# Altium schematic sheet soldeer.SchDoc
size A4; SheetNumber: 3; SheetTotal: 4
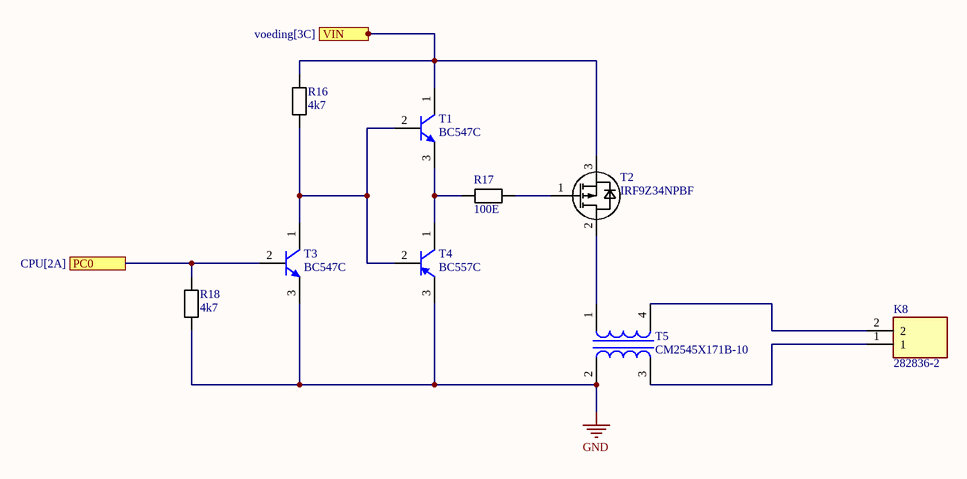
[diagram p0: soldeer.SchDoc]

## Parts
K8  282836-2  [Schroefconnector 2 Pin]
R16  4k7  [registor]
R17  100E  [registor]
R18  4k7  [registor]
T1  BC547C  [BC547C]
T2  IRF9Z34NPBF  [IRF9Z34NPBF]
T3  BC547C  [BC547C]
T4  BC557C  [BC557C]
T5  CM2545X171B-10  [CM2545X171B-10]

## Ports
PC0 (see CPU[2A]), VIN (see voeding[3C])

## Nets
GND: R18.1 T3.3(E) T4.3(E) T5.2
PC0: R18.2 T3.2(B) ; port PC0
VIN: R16.2 T1.1(C) T2.3(SOURCE) ; port VIN
NetK8_1: K8.1 T5.3
NetK8_2: K8.2 T5.4
NetR16_1: R16.1 T1.2(B) T3.1(C) T4.2(B)
NetR17_1: R17.1 T1.3(E) T4.1(C)
NetR17_2: R17.2 T2.1(GATE)
NetT2_2: T2.2(DRAIN) T5.1

## Library data of the parts
K8 = Schroefconnector 2 Pin L: Connector; Manufacturer_Name: TE Connectivity; Datasheet Link: https://www.te.com/commerce/DocumentDelivery/DDEController?Action=showdoc&DocId=Customer+Drawing%7F282836%7FJ%7Fpdf%7FEnglish%7FENG_CD_282836_J.pdf%7F282836-2; Height: 10mm; Manufacturer_Part_Number: 282836-2
R16-R18 = resistor: Manufacturer: Vishay Dale; Part Number: CRCW08050000Z0EA
T1 T3 = BC547C: Amplifier Transistor, NPN Silicon, 3-Pin TO-92, Pb-Free, Bulk Box; Manufacturer: On Semiconductor; PartNumber: BC547CG; IC Continuous (A): 0.1; fT Min (MHz): 150; ComponentLink3URL: http://www.onsemi.cn/pub_link/Collateral/2N6426-D.PDF; Mounting Technology: Through Hole; PackageReference: TO-92-3-29-11_AM_SL; ComponentLink2Description: Datasheet; RoHS: TRUE; Packing: Bulk Box; ComponentLink1Description: Manufacturer URL; PackageDescription: 3-Pin Transistor Outline, Body 4.825 x 3.685 mm, Pitch 1.27 mm; PackageVersion: Rev. AM; ComponentLink2URL: http://www.onsemi.com/pub_link/Collateral/BC546-D.PDF; ComponentLink3Description: Package Specification; ComponentLink1URL: http://www.onsemi.com/; DatasheetVersion: Rev. 7; Polarity: NPN
T2 = IRF9Z34NPBF: OptiMOS - P2 Power-Transistor, P-channel-Enhancement mode, VDS -30V; Manufacturer: Infineon Technologies; Manufacturer Order NumberManufacturer Order Number: IRF9Z34N; PackageReference: PG-TO220-3-904
T4 = BC557C: Amplifier Transistor, PNP Silicon, 3-Pin TO-92, Bulk Box; Manufacturer: On Semiconductor; IC Continuous (A): -0.1; Polarity: PNP; PartNumber: BC557C; PackageVersion: Rev. AM; RoHS: FALSE; PackageDescription: 3-Pin Transistor Outline, Body 4.825 x 3.685 mm, Pitch 1.27 mm; Packing: Bulk Box; ComponentLink2Description: Datasheet; DatasheetVersion: Rev. 3; ComponentLink3Description: Package Specification; Mounting Technology: Through Hole; ComponentLink2URL: http://www.onsemi.com/pub_link/Collateral/BC556B-D.PDF; ComponentLink1URL: http://www.onsemi.com/; ComponentLink1Description: Manufacturer URL; ComponentLink3URL: http://www.onsemi.cn/pub_link/Collateral/2N6426-D.PDF; PackageReference: TO-92-3-29-11_AM_SL
T5 = CM2545X171B-10: 2 Line Common Mode Choke Through Hole 170 Ohms @ 100 MHz 10A DCR 10mOhm; MF: Laird; Value: *; Purchase-URL: https://pricing.snapeda.com/search/part/CM2545X171B-10/?ref=eda; Price: None; Package: Vertical-4 Laird; SnapEDA_Link: https://www.snapeda.com/parts/CM2545X171B-10/Laird/view-part/?ref=snap; Availability: In Stock; Check_prices: https://www.snapeda.com/parts/CM2545X171B-10/Laird/view-part/?ref=eda; MP: CM2545X171B-10